# Altium schematic sheet Power_Supply.SchDoc
size A4
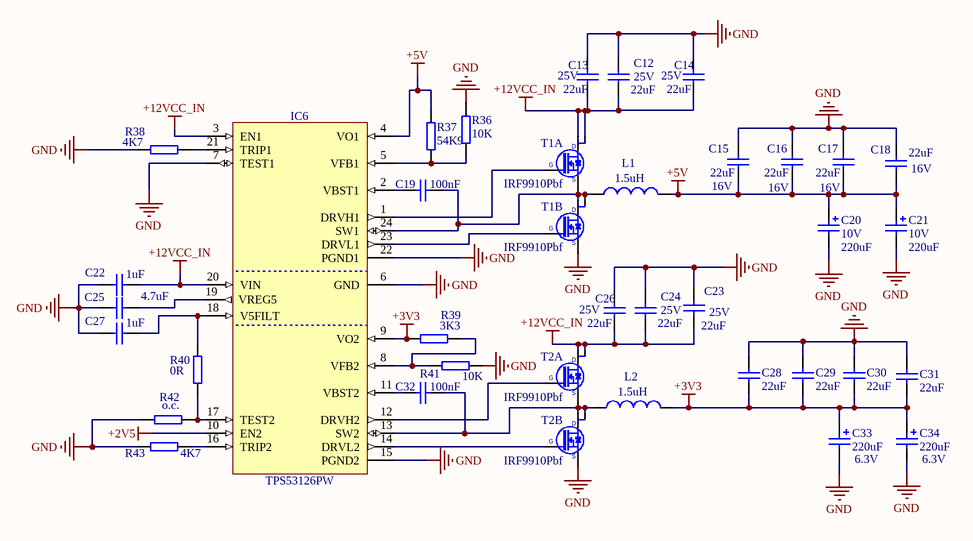
[diagram p0: Power_Supply.SchDoc]

## Parts
C12  value 22uF  Voltage: 25V  [CC3216-1206]  (hidden comment: 22uF 25V)
C13  value 22uF  Voltage: 25V  [CC3216-1206]  (hidden comment: 22uF 25V)
C14  value 22uF  Voltage: 25V  [CC3216-1206]  (hidden comment: 22uF 25V)
C15  value 22uF  Voltage: 16V  [CC2012-0805]  (hidden comment: 22uF 16V)
C16  value 22uF  Voltage: 16V  [CC2012-0805]  (hidden comment: 22uF 16V)
C17  value 22uF  Voltage: 16V  [CC2012-0805]  (hidden comment: 22uF 16V)
C18  value 22uF  Voltage: 16V  [CC2012-0805]  (hidden comment: 22uF 16V)
C19  100nF  [CC1608-0603]
C20  value 220uF  Voltage: 10V  [D]  (hidden comment: 220uF 10V)
C21  value 220uF  Voltage: 10V  [D]  (hidden comment: 220uF 10V)
C22  1uF  [CC1608-0603]
C23  value 22uF  Voltage: 25V  [CC3216-1206]  (hidden comment: 22uF 25V)
C24  value 22uF  Voltage: 25V  [CC3216-1206]  (hidden comment: 22uF 25V)
C25  4.7uF  [CC1608-0603]
C26  value 22uF  Voltage: 25V  [CC3216-1206]  (hidden comment: 22uF 25V)
C27  1uF  [CC1608-0603]
C28  22uF  [CC2012-0805]
C29  22uF  [CC2012-0805]
C30  22uF  [CC2012-0805]
C31  22uF  [CC2012-0805]
C32  100nF  [CC1608-0603]
C33  Voltage: 6.3V  [D]  (hidden comment: 220uF)
C34  Voltage: 6.3V  [D]  (hidden comment: 220uF)
IC6  TPS53126PW  [SOP65P640X120-24N]
L1  value 1.5uH  [IHLP2525]  (hidden comment: IHLP2525CZER1R5M01)
L2  value 1.5uH  [IHLP2525]  (hidden comment: IHLP2525CZER1R5M01)
R36  10K  [0603]
R37  54K9  [0603]
R38  4K7  [0603]
R39  3K3  [0603]
R40  0R  [0603]
R41  10K  [0603]
R42  o.c.  [0603]
R43  4K7  [0603]
T1  IRF9910Pbf  [SOIC127P600X175-8N]  (parts A,B of 2)
T2  IRF9910Pbf  [SOIC127P600X175-8N]  (parts A,B of 2)

## Nets
+2V5: IC6.10(EN2)
+3V3: C28.2 C29.1 C30.1 C31.1 C33.1 C34.1 IC6.9(VO2) L2.2 R39.1
+5V: C15.1 C16.1 C17.1 C18.1 C20.1 C21.1 IC6.4(VO1) L1.2 R37.2
+12VCC_IN: C12.1 C13.1 C14.1 C22.2 C23.1 C24.1 C26.1 IC6.3(EN1) IC6.20(VIN) T1.5(D) T1.6(D) T2.5(D) T2.6(D)
GND: C12.2 C13.2 C14.2 C15.2 C16.2 C17.2 C18.2 C20.2 C21.2 C22.1 C23.2 C24.2 C25.2 C26.2 C27.1 C28.1 C29.2 C30.2 C31.2 C33.2 C34.2 IC6.6(GND) IC6.7(TEST1) IC6.15(PGND2) IC6.22(PGND1) R36.2 R38.2 R41.1 R42.2 R43.2 T1.1(S) T2.1(S)
NetC19_1: C19.1 IC6.24(SW1) L1.1 T1.3(S) T1.7(D) T1.8(D)
NetC19_2: C19.2 IC6.2(VBST1)
NetC25_1: C25.1 IC6.19(VREG5)
NetC27_2: C27.2 IC6.18(V5FILT) R40.1
NetC32_1: C32.1 IC6.13(SW2) L2.1 T2.3(S) T2.7(D) T2.8(D)
NetC32_2: C32.2 IC6.11(VBST2)
NetIC6_1: IC6.1(DRVH1) T1.4(G)
NetIC6_5: IC6.5(VFB1) R36.1 R37.1
NetIC6_8: IC6.8(VFB2) R39.2 R41.2
NetIC6_12: IC6.12(DRVH2) T2.4(G)
NetIC6_14: IC6.14(DRVL2) T2.2(G)
NetIC6_16: IC6.16(TRIP2) R43.1
NetIC6_17: IC6.17(TEST2) R40.2 R42.1
NetIC6_21: IC6.21(TRIP1) R38.1
NetIC6_23: IC6.23(DRVL1) T1.2(G)

## Library data of the parts
C12-C14 C23 C24 C26 = CC1206_22UF_25V_10%_X5R: Capacitor; Manufacturer1: Murata; Manufacturer1 PN: GRM31CR61E226KE15L; TC: X5R; Tolerance: ±10%; Published: 8-Jun-2000; LatestRevisionDate: 17-Jul-2002; LatestRevisionNote: Re-released for DXP Platform.; PackageReference: RAD-0.3; Publisher: Altium Limited; Distributor1: Digikey; Distributor1 PN: 490-5527-1-ND; Case: 1206
C15-C18 = CC0805_22UF_16V_10%_X5R: Capacitor; Manufacturer1: Phycomp; Manufacturer1 PN: C2012X5R1C226K; TC: X7R; Tolerance: ±10%; Published: 8-Jun-2000; LatestRevisionDate: 17-Jul-2002; LatestRevisionNote: Re-released for DXP Platform.; PackageReference: RAD-0.3; Publisher: Altium Limited; Distributor1: Digikey; Distributor1 PN: 445-6797-1-ND; Case: 0805
C19 C32 = CC0603_100NF_16V_10%_X7R: Capacitor; Manufacturer1: AVX; Manufacturer1 PN: 0603YC104KAT2A; TC: X7R; Tolerance: ±10%; Voltage: 16V; Published: 8-Jun-2000; LatestRevisionDate: 17-Jul-2002; LatestRevisionNote: Re-released for DXP Platform.; PackageReference: RAD-0.3; Publisher: Altium Limited; Distributor1: Digikey; Distributor1 PN: 478-1239-1-ND; Case: 0603; Value: 100nF
C20 C21 = CP2917_220UF_10V_20%_TANT: Polarized Capacitor Tantalum; Manufacturer1: Kemet; Manufacturer1 PN: T520D227M010ATE018; Tolerance: ±20%; ESR: 18mOhm; Published: 8-Jun-2000; LatestRevisionDate: 17-Jul-2002; LatestRevisionNote: Re-released for DXP Platform.; PackageReference: RB7.6-15; Publisher: Altium Limited; Case: 2917; Distributor1: Digikey; Distributor1 PN: 399-4045-1-ND; TC: Tantalum
C22 C27 = CC0603_1UF_25V_10%_X5R: Capacitor; Manufacturer1: Phycomp; Manufacturer1 PN: GRM188R61E105KA12D; TC: X5R; Tolerance: ±10%; Voltage: 25V; Published: 8-Jun-2000; LatestRevisionDate: 17-Jul-2002; LatestRevisionNote: Re-released for DXP Platform.; Publisher: Altium Limited; Distributor1: Digikey; Distributor1 PN: 490-3897-1-ND; Case: 0603; Value: 1uF
C25 = CC0603_4.7UF_10V_10%_X5R: Capacitor; Manufacturer1: TDK; Manufacturer1 PN: C1608X5R1A475K; TC: X5R; Tolerance: ±10%; Voltage: 10V; Published: 8-Jun-2000; LatestRevisionDate: 17-Jul-2002; LatestRevisionNote: Re-released for DXP Platform.; PackageReference: RAD-0.3; Publisher: Altium Limited; Distributor1: Digikey; Distributor1 PN: 445-5170-1-ND; Case: 0603; Value: 4.7uF
C28-C31 = CC0805_22UF_6.3V_20%_X5R: Capacitor; Manufacturer1: TDK; Manufacturer1 PN: C2012X5R0J226M; TC: X5R; Tolerance: ±20%; Voltage: 6.3V; Published: 8-Jun-2000; LatestRevisionDate: 17-Jul-2002; LatestRevisionNote: Re-released for DXP Platform.; PackageReference: RAD-0.3; Publisher: Altium Limited; Distributor1: Digikey; Distributor1 PN: 445-1422-1-ND; Case: 0805; Value: 22uF
C33 C34 = CP2917_220UF_6.3V_20%_TANT: Polarized Capacitor Tantalum; Manufacturer1: Kemet; Manufacturer1 PN: T520D227M006ATE009; Tolerance: ±20%; ESR: 9mOhm; Published: 8-Jun-2000; LatestRevisionDate: 17-Jul-2002; LatestRevisionNote: Re-released for DXP Platform.; PackageReference: RB7.6-15; Publisher: Altium Limited; Case: 2917; Distributor1: Digikey; Distributor1 PN: T520D227M006ATE009; TC: Tantalum; Value: 220uF
IC6 = TPS53126PW: Dual Synchronous Step-Down Controller For Low Voltage Power Rails; Manufacturer: TEXAS INSTRUMENTS; Table: Analog & Interface; Part Number: TPS53126PW; Component Kind: Standard; Component Type: Standard; Device: TPS53126PW; PackageDescription: SOP, 0.65mm Pitch; 24 Pin, 4.40mm W X 7.80mm L X 1.20mm H Body, IPC Medium Density; Part Description: Dual Synchronous Step-Down Controller For Low Voltage Power Rails; Manufacturer Part Number: TPS53126PW; Pin Count: 24; Case: QFN24; Mounted: Yes; Socket: No; SMD: Yes; ComponentHeight: 1.0mm; Author: CERN DEM JLC; HelpURL: \\cern.ch\dfs\Applications\Altium\Datasheets\TPS53126RGET.pdf; CreateDate: 2010-08-26; LatestRevisionDate: 2010-08-26; Distributor1: Digikey; Distributor1 PN: 296-24555-1-ND
L1 L2 = Inductor: Low Profile, High Current Inductor; Manufacturer: Vishay/Dale; Published: 8-Jun-2000; Revision: July-2002: Re-released for DXP Platform.; Publisher: Altium Limited; Manufacturer PN: IHLP2525CZER1R5M01; Distributor1 PN: 541-1007-1-ND; Distributor1: Digikey
R36 R41 = R0603_10K_±1%_0.2W_100PPM: SMD Resistor; Manufacturer1: Rohm; Manufacturer1 PN: ESR03EZPF1002; TCR: 100ppm; Power Rating: 0.2W; Tolerance: ±1%; Case: 0603; Distributor1: DigiKey; Distributor1 PN: RHM10KADCT-ND; Value: 10K
R37 = R0603_54K9_±1%_0.1W_100PPM: SMD Resistor; Manufacturer1: Panasonic; Manufacturer1 PN: ERJ-3EKF5492V; TCR: 100ppm; Power Rating: 0.1W; Tolerance: ±1%; Case: 0603; Distributor1: DigiKey; Distributor1 PN: P54.9KHCT-ND; Value: 54K9
R38 R43 = R0603_4.7K_±1%_0.1W_100PPM: SMD Resistor; Manufacturer1: Panasonic; Manufacturer1 PN: ERJ-3EKF4701V; TCR: 100ppm; Power Rating: 0.1W; Tolerance: ±1%; Case: 0603; Distributor1: DigiKey; Distributor1 PN: P4.70KHCT-ND; Value: 4K7
R39 = R0603_3K3_±1%_0.1W_100PPM: SMD Resistor; Manufacturer1: Yageo; Manufacturer1 PN: RC0603FR-073K3L; TCR: 100ppm; Power Rating: 0.1W; Tolerance: ±1%; Case: 0603; Distributor1: DigiKey; Distributor1 PN: 311-3.30KHRCT-ND; Value: 3K3
R40 = R0603_0R_0.1W_JUMPER: SMD Resistor; Manufacturer1: Yageo; Manufacturer1 PN: RC0603JR-070RL; TCR: 200ppm; Power Rating: 0.1W; Case: 0603; Distributor1: DigiKey; Distributor1 PN: 311-0.0GRCT-ND; Tolerance: -; Value: 0R
R42 = R0603_O.C.: SMD Resistor; Manufacturer1: NA; Case: 0603; Manufacturer1 PN: NA; Distributor1: NA; Distributor1 PN: NA; TCR: NA; Power Rating: NA; Tolerance: NA; Value: o.c.
T1 T2 = IRF9910Pbf: Dual SO-8 MOSFET For POL Cconverter; Part Description: 20V 10A(Q1) 20V 12A (Q2) Dual SO-8 MOSFET For POL Cconverter; Manufacturer: INTERNATIONAL RECTIFIER; Table: Transistors; Part Number: IRF9910Pbf; Component Kind: Standard; Component Type: Standard; Device: IRF9910Pbf; PackageDescription: SOIC 8, Pitch 1.27mm - Body 4x5mm, IPC Medium Density; Manufacturer Part Number: IRF9910Pbf; Pin Count: 8; Case: DO8; Mounted: Yes; Socket: No; SMD: Yes; ComponentHeight: 1.75mm; HelpURL: \\cern.ch\dfs\Applications\Altium\Datasheets\IRF9910Pbf.pdf; Author: CERN DEM JLC; CreateDate: 30/08/2010; LatestRevisionDate: 30/08/2010